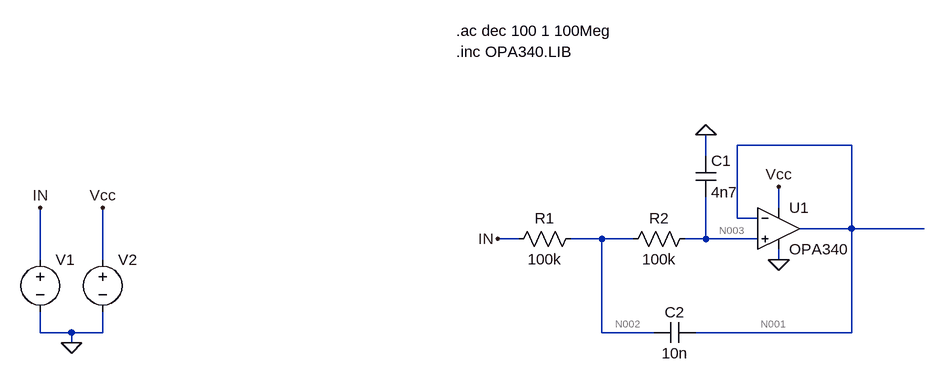
[diagram p0: schematic Sallen-Key-Filter_getrieben.asc]
Sallen-Key-Filter_getrieben.asc, the LTspice schematic file:
Version 4
SHEET 1 916 680
WIRE 800 96 624 96
WIRE 576 112 576 80
WIRE 688 192 688 160
WIRE 624 208 624 96
WIRE 656 208 624 208
WIRE 800 224 800 96
WIRE 800 224 720 224
WIRE 912 224 800 224
WIRE 288 240 256 240
WIRE 416 240 368 240
WIRE 464 240 416 240
WIRE 576 240 576 176
WIRE 576 240 544 240
WIRE 656 240 576 240
WIRE -448 272 -448 192
WIRE -352 272 -352 192
WIRE 688 272 688 256
WIRE -448 384 -448 352
WIRE -400 384 -448 384
WIRE -352 384 -352 352
WIRE -352 384 -400 384
WIRE 416 384 416 240
WIRE 496 384 416 384
WIRE 800 384 800 224
WIRE 800 384 560 384
WIRE -400 400 -400 384
FLAG 576 80 0
FLAG 688 272 0
FLAG 688 160 Vcc
FLAG 256 240 IN
FLAG -400 400 0
FLAG -448 192 IN
FLAG -352 192 Vcc
SYMBOL res 384 224 R90
WINDOW 0 0 56 VBottom 2
WINDOW 3 32 56 VTop 2
SYMATTR InstName R1
SYMATTR Value 100k
SYMBOL res 560 224 R90
WINDOW 0 0 56 VBottom 2
WINDOW 3 32 56 VTop 2
SYMATTR InstName R2
SYMATTR Value 100k
SYMBOL cap 560 112 R0
SYMATTR InstName C1
SYMATTR Value 4n7
SYMBOL cap 560 368 R90
WINDOW 0 0 32 VBottom 2
WINDOW 3 32 32 VTop 2
SYMATTR InstName C2
SYMATTR Value 10n
SYMBOL Opamps\\opamp2 688 160 R0
SYMATTR InstName U1
SYMATTR Value OPA340
SYMATTR SpiceModel OPA340
SYMBOL voltage -448 256 R0
WINDOW 39 0 0 Left 2
SYMATTR InstName V1
SYMATTR Value ""
SYMATTR Value2 AC 1
SYMBOL voltage -352 256 R0
WINDOW 3 24 96 Invisible 2
WINDOW 123 0 0 Left 2
WINDOW 39 0 0 Left 2
SYMATTR Value 5
SYMATTR InstName V2
TEXT 192 -48 Left 2 !.inc OPA340.LIB
TEXT 192 -80 Left 2 !.ac dec 100 1 100Meg

The netlist it stands for:
* Sallen-Key-Filter_getrieben.asc
R1 N002 IN 100k
R2 N003 N002 100k
C1 0 N003 4n7
C2 N001 N002 10n
XU1 N003 N001 Vcc 0 N001 OPA340 OPA340  ; pins In+ In- V+ V- OUT
V1 IN 0 AC 1
V2 Vcc 0 5
.inc OPA340.LIB
.ac dec 100 1 100Meg
.backanno
.end

* Results of the author's LTspice run, read from the files saved beside the schematic
* Operating Point, zero values left out:
*   V(n002) = 481 nV
*   V(n003) = 962 nV
*   V(n001) = 3.096 µV
*   V(vcc) = 5 V
*   I(R2) = 4.81 pA
*   I(R1) = 4.81 pA
*   I(V2) = -685.3 µA
*   I(V1) = 4.81 pA
*   Ix(u1:+) = -4.81 pA
*   Ix(u1:-) = -4.81 pA
*   Ix(u1:V+) = 685.3 µA
*   Ix(u1:V-) = -685.3 µA
*   Ix(u1:OUT) = 4.81 pA
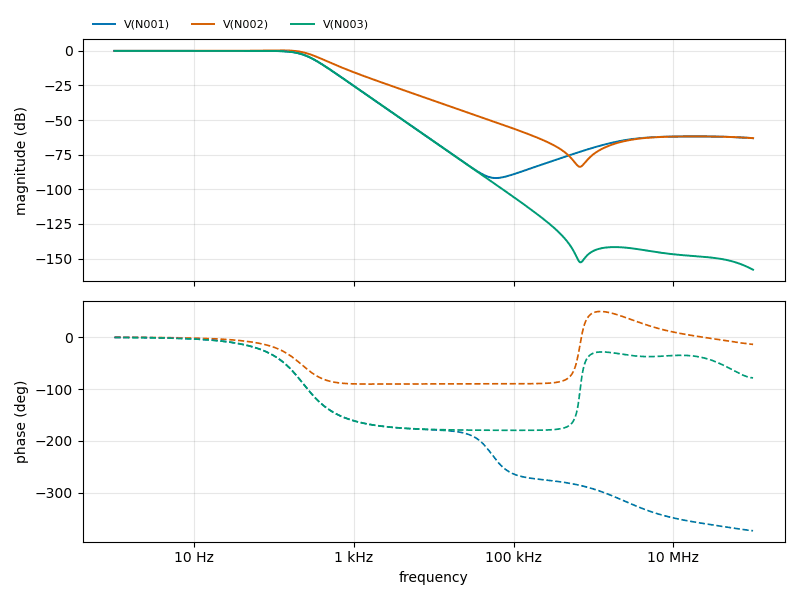
[diagram p1: AC Analysis of Sallen-Key-Filter_getrieben.asc, plotted from the saved traces]
* AC Analysis, 1 run:
*   V(N001): -0.00 dB at 1 Hz, -63.04 dB at 100 MHz, peak 0.01 dB at 56.23 Hz, 3 dB below the peak at 238.7 Hz
*   V(N002): 0.00 dB at 1 Hz, -63.03 dB at 100 MHz, peak 0.35 dB at 123 Hz, 3 dB below the peak at 287.9 Hz
*   V(N003): 0.00 dB at 1 Hz, -158.06 dB at 100 MHz, peak 0.02 dB at 56.23 Hz, 3 dB below the peak at 238.7 Hz